# Altium project Drawdio.PrjPcb
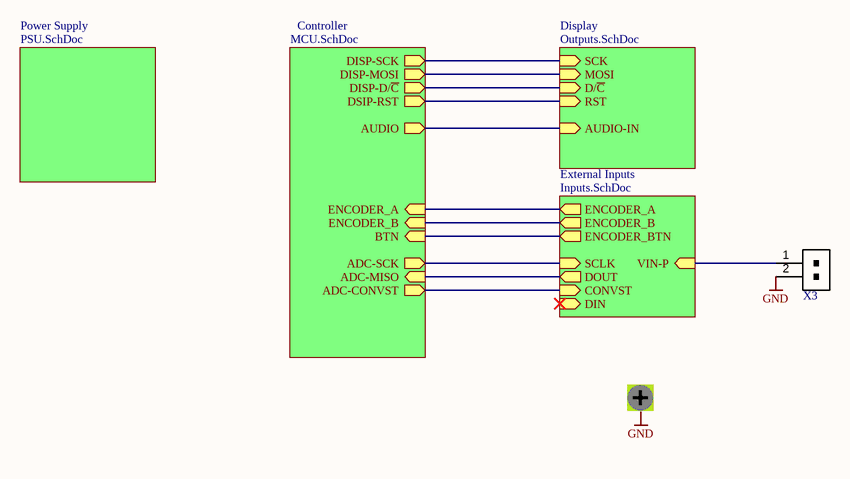
[diagram p0: Drawdio.SchDoc]
DrawingScale: 1:1; ProjAuthor: Szabó Péter; ProjName: Drawdio; ProjRev: Rev.1.0.
5 sheets, 116 parts. Net scope: hierarchical (ports join the sheet entries above them; power ports are global).
Board file: Drawdio.PcbDoc
Sheets:
  Drawdio.SchDoc
    Controller = MCU.SchDoc
    Power Supply = PSU.SchDoc
    External Inputs = Inputs.SchDoc
    Display = Outputs.SchDoc

## Sheet Drawdio.SchDoc: Drawdio w/ OLED dispaly
size 297 x 209 mm; DrawnBy: Szabó Péter; DocumentNumber: SP-0331; Revision: Rev.1.0.; SheetNumber: 1; SheetTotal: 5; Project: Drawdio; Scale: 1:1

### Parts
MH1  MECH - M2 screw  [MECH-M2 - no screw]  (value not drawn)
X3  CONN - 2P -THT-JST 2.00mm  [CONN-2P-THT-RIGHT-JST 2.00mm]  (value not drawn)

### Sub-sheets
Controller = MCU.SchDoc: BTN (in), ENCODER_B (in), ENCODER_A (in), DISP-MOSI (out), DISP-SCK (out), DSIP-RST (out), DISP-D/~{C} (out), ADC-CONVST (out), ADC-SCK (out), ADC-MISO (in), AUDIO (out)
Display = Outputs.SchDoc: MOSI (in), RST (in), SCK (in), D/~{C} (in), AUDIO-IN (in)
External Inputs = Inputs.SchDoc: ENCODER_A (out), ENCODER_B (out), ENCODER_BTN (out), DIN (in), SCLK (in), DOUT (out), CONVST (in), VIN-P (in)
Power Supply = PSU.SchDoc: no entries

### Nets
GND: MH1.MH(Con) X3.2
ADC-CONVST: sheet Controller/ADC-CONVST, sheet External Inputs/CONVST
ADC-MISO: sheet Controller/ADC-MISO, sheet External Inputs/DOUT
ADC-SCK: sheet Controller/ADC-SCK, sheet External Inputs/SCLK
BTN: sheet Controller/BTN, sheet External Inputs/ENCODER_BTN
DAC-OUT: sheet Controller/AUDIO, sheet Display/AUDIO-IN
DISP-D/~{C}: sheet Controller/DISP-D/~{C}, sheet Display/D/~{C}
DSIP-RST: sheet Controller/DSIP-RST, sheet Display/RST
ENC_A: sheet Controller/ENCODER_A, sheet External Inputs/ENCODER_A
ENC_B: sheet Controller/ENCODER_B, sheet External Inputs/ENCODER_B
SPI-MOSI: sheet Controller/DISP-MOSI, sheet Display/MOSI
SPI-SCK: sheet Controller/DISP-SCK, sheet Display/SCK
NetR29_3: X3.1 ; sheet External Inputs/VIN-P

### Notes on the sheet
- PROJECT NAME
- DATE
- TITLE
- TIME
- VERSION CONTROL
- N/A
- SIZE
- SCALE:
- A4
- FILE NAME
- DWG NO.
- SHEET
- REV
- OF
- DRAWN BY:

### Library data of the parts
MH1 = MECH - M2 screw: M3 hole with screw; Distributor: *; Order number: *
X3 = CONN - 2P -THT-JST 2.00mm: 1x2 pin THT connector; Order number: 100.385.23; 100.341.10; Distributor: Hestore

## Sheet MCU.SchDoc: Drawdio MCU
size 297 x 209 mm; DrawnBy: Szabó Péter; DocumentNumber: SP-0332; Revision: Rev.1.0.; SheetNumber: 2; SheetTotal: 5; Project: Drawdio; Scale: 1:1
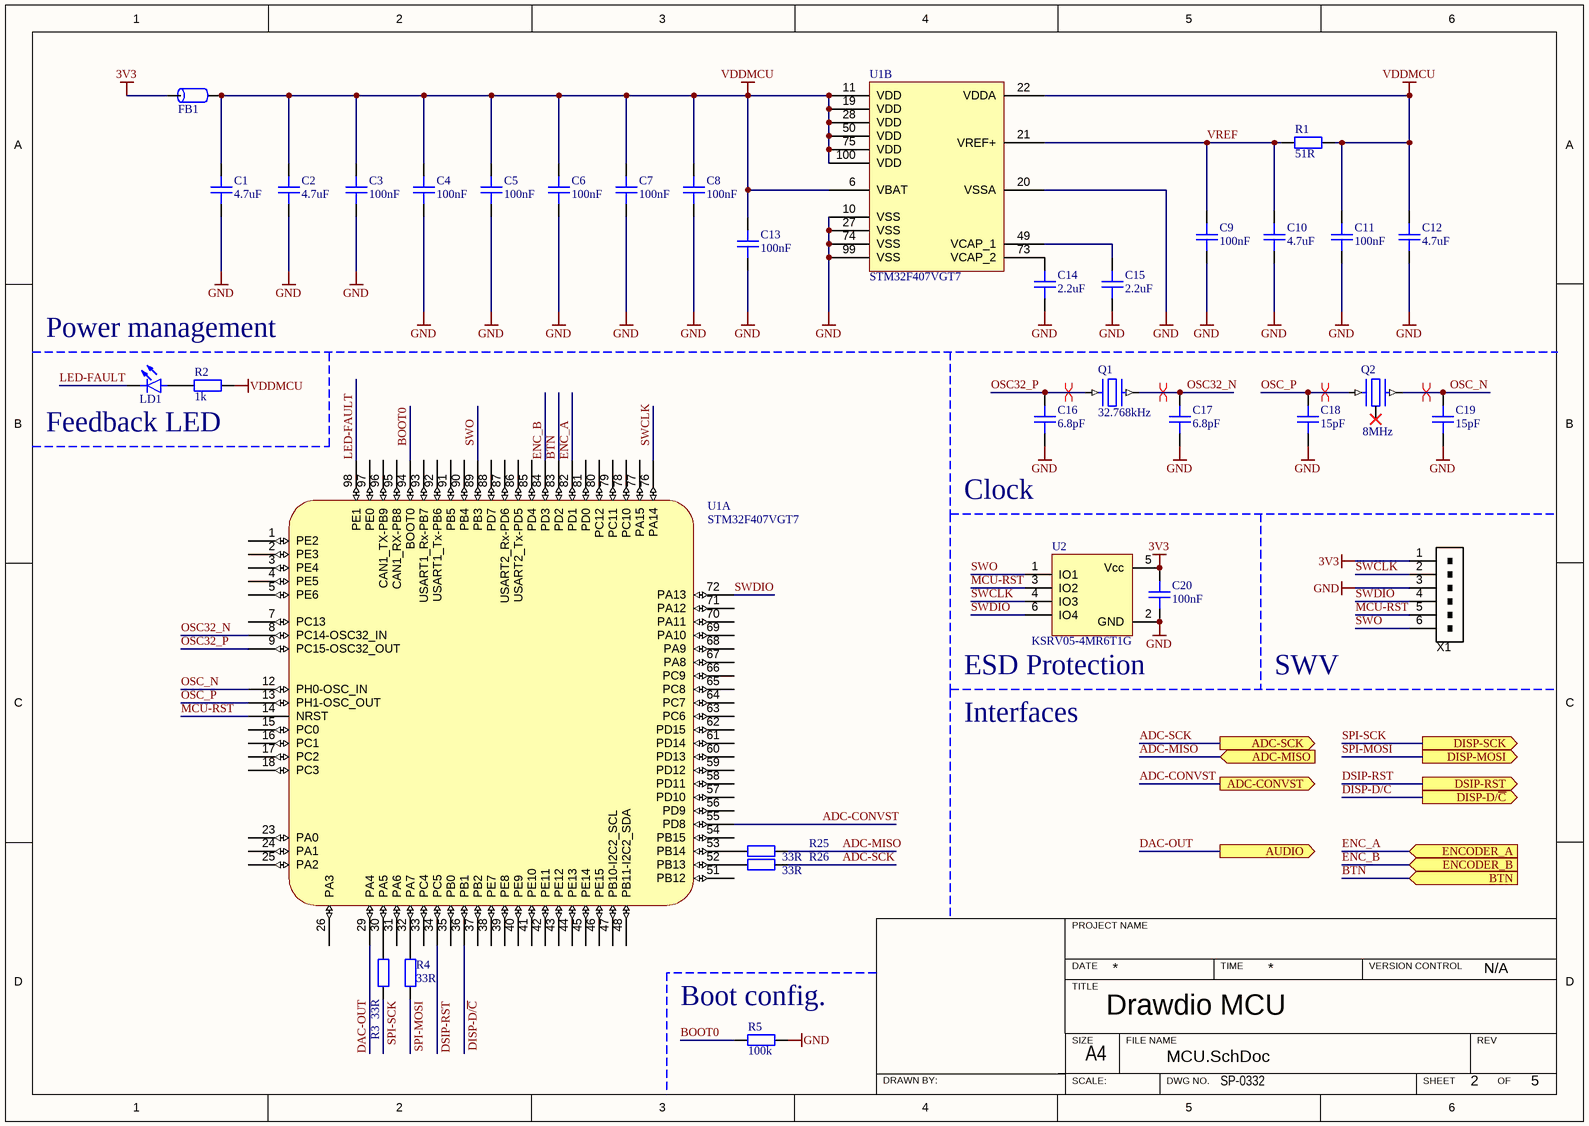
[diagram p1: MCU.SchDoc]

### Parts
C1  4.7uF  [CAP-0805]
C2  4.7uF  [CAP-0805]
C3  100nF  [CAP-0603]
C4  100nF  [CAP-0603]
C5  100nF  [CAP-0603]
C6  100nF  [CAP-0603]
C7  100nF  [CAP-0603]
C8  100nF  [CAP-0603]
C9  100nF  [CAP-0603]
C10  4.7uF  [CAP-0805]
C11  100nF  [CAP-0603]
C12  4.7uF  [CAP-0805]
C13  100nF  [CAP-0603]
C14  2.2uF  [CAP-0805]
C15  2.2uF  [CAP-0805]
C16  6.8pF  [CAP-0603]
C17  6.8pF  [CAP-0603]
C18  15pF  [CAP-0603]
C19  15pF  [CAP-0603]
C20  100nF  [CAP-0603]
FB1  FB - 0603  [FB-0603]  (value not drawn)
LD1  LED - 0603  [LED-0603]  (value not drawn)
Q1  32.768kHz  [OSC-3.2x1.5]
Q2  8MHz  [OSC-3.2x2.5]
R1  51R  [RES-0603]
R2  1k  [RES-0603]
R3  33R  [RES-0603]
R4  33R  [RES-0603]
R5  100k  [RES-0603]
R25  33R  [RES-0603]
R26  33R  [RES-0603]
U1  STM32F407VGT7  [IC-TQFP-100]  (parts A,B of 2)
U2  KSRV05-4MR6T1G  [T-SOT-23-6]
X1  CONN - SWV  [CONN-SWV-THT FEMALE]  (value not drawn)

### Ports
ADC-CONVST (out), ADC-MISO (in), ADC-SCK (out), AUDIO (out), BTN (in), DISP-D/~{C} (out), DISP-MOSI (out), DISP-SCK (out), DSIP-RST (out), ENCODER_A (in), ENCODER_B (in)

### Nets
3V3: C20.2 FB1.1 U2.5(Vcc) X1.1
GND: C1.1 C2.1 C3.1 C4.1 C5.1 C6.1 C7.1 C8.1 C9.1 C10.1 C11.1 C12.1 C13.1 C14.1 C15.1 C16.1 C17.1 C18.1 C19.1 C20.1 R5.2 U1.10(VSS) U1.20(VSSA) U1.27(VSS) U1.74(VSS) U1.99(VSS) U2.2(GND) X1.3
VDDMCU: C1.2 C2.2 C3.2 C4.2 C5.2 C6.2 C7.2 C8.2 C11.2 C12.2 C13.2 FB1.2 R1.2 R2.1 U1.6(VBAT) U1.11(VDD) U1.19(VDD) U1.22(VDDA) U1.28(VDD) U1.50(VDD) U1.75(VDD) U1.100(VDD)
ADC-CONVST: U1.55(PD8) ; port ADC-CONVST
ADC-MISO: R25.2 ; port ADC-MISO
ADC-SCK: R26.2 ; port ADC-SCK
BOOT0: R5.1 U1.94(BOOT0)
BTN: U1.83(PD2) ; port BTN
DAC-OUT: U1.29(PA4) ; port AUDIO
DISP-D/~{C}: U1.36(PB1) ; port DISP-D/~{C}
DSIP-RST: U1.34(PC5) ; port DSIP-RST
ENC_A: U1.82(PD1) ; port ENCODER_A
ENC_B: U1.84(PD3) ; port ENCODER_B
LED-FAULT: LD1.2(K) U1.98(PE1)
MCU-RST: U1.14(NRST) U2.3(IO2) X1.5
OSC32_N: C17.2 Q1.4 U1.8(PC14-OSC32_IN)
OSC32_P: C16.2 Q1.1 U1.9(PC15-OSC32_OUT)
OSC_N: C19.2 Q2.2 U1.12(PH0-OSC_IN)
OSC_P: C18.2 Q2.1 U1.13(PH1-OSC_OUT)
SPI-MOSI: R4.2 ; port DISP-MOSI
SPI-SCK: R3.2 ; port DISP-SCK
SWCLK: U1.76(PA14) U2.4(IO3) X1.2
SWDIO: U1.72(PA13) U2.6(IO4) X1.4
SWO: U1.89(PB3) U2.1(IO1) X1.6
VREF: C9.2 C10.2 R1.1 U1.21(VREF+)
NetC14_2: C14.2 U1.73(VCAP_2)
NetC15_2: C15.2 U1.49(VCAP_1)
NetLD1_1: LD1.1(A) R2.2
NetR3_1: R3.1 U1.30(PA5)
NetR4_1: R4.1 U1.32(PA7)
NetR25_1: R25.1 U1.53(PB14)
NetR26_1: R26.1 U1.52(PB13)

Not connected (* = marked no-connect by the designer): Q2 3*; U1 1(PE2) 2(PE3) 3(PE4) 4(PE5) 5(PE6) 7(PC13) 15(PC0) 16(PC1) 17(PC2) 18(PC3) 23(PA0) 24(PA1) 25(PA2) 26(PA3) 31(PA6) 33(PC4) 35(PB0) 37(PB2) 38(PE7) 39(PE8) 40(PE9) 41(PE10) 42(PE11) 43(PE12) 44(PE13) 45(PE14) 46(PE15) 47(PB10-I2C2_SCL) 48(PB11-I2C2_SDA) 51(PB12) 54(PB15) 56(PD9) 57(PD10) 58(PD11) 59(PD12) 60(PD13) 61(PD14) 62(PD15) 63(PC6) 64(PC7) 65(PC8) 66(PC9) 67(PA8) 68(PA9) 69(PA10) 70(PA11) 71(PA12) 77(PA15) 78(PC10) 79(PC11) 80(PC12) 81(PD0) 85(PD4) 86(USART2_Tx-PD5) 87(USART2_Rx-PD6) 88(PD7) 90(PB4) 91(PB5) 92(USART1_Tx-PB6) 93(USART1_Rx-PB7) 95(CAN1_RX-PB8) 96(CAN1_TX-PB9) 97(PE0)

### Layout directives
differential pair: OSC32_N, OSC32_P, OSC_N, OSC_P

### Notes on the sheet
- Power management
- Feedback LED
- Clock
- ESD Protection
- Interfaces
- SWV
- (near R5) Boot config.
- PROJECT NAME
- DATE
- TITLE
- TIME
- VERSION CONTROL
- N/A
- SIZE
- SCALE:
- A4
- FILE NAME
- DWG NO.
- SHEET
- REV
- OF
- DRAWN BY:

### Library data of the parts
C1 C2 C10 C12 C14 C15 = CAP - 0805: Capacitor Non-Polar; Distributor: *; Order number: *
  C1 C2 C10 C12: Value: 4.7uF
  C14 C15: Value: 2.2uF
C3-C9 C11 C13 C16-C20 = CAP - 0603: Capacitor Non-Polar; Distributor: *; Order number: *
  C3-C9 C11 C13 C20: Value: 100nF
  C16 C17: Value: 6.8pF
  C18 C19: Value: 15pF
FB1 = FB - 0603: Ferrit bead 0603
LD1 = LED - 0603: Single color LED; Distributor: *; Order number: *
Q1 = OSC - RTC: 32.768kHz quartz; Order number: 40-02-49; Distributor: Lomex
Q2 = OSC - MHZ SMD: 8MHz quartz; Value: 8MHz; Distributor: *; Order number: *
R1-R5 R25 R26 = RES - 0603: Resistor; Distributor: *; Order number: *
  R1: Value: 51R
  R2: Value: 1k
  R3 R4 R25 R26: Value: 33R
  R5: Value: 100k
U1 = IC - STM32F407VGxx: High-performance and DSP with FPU, ARM Cortex-M4 MCU with 1 Mbyte Flash, 168 MHz CPU, Art Accelerator, Ethernet; Order number: 2064368; Distributor: Farnell; Supplier 1: Farnell; Supplier Part Number 1: 2333298
U2 = D - KSRV05: ESD supressor, max. 28V, 150W; Order number: 100.459.44; Distributor: Hestore
X1 = CONN - SWV: SWD view and program connector; Distributor: *; Order number: *

## Sheet PSU.SchDoc: Power Supply
size 297 x 209 mm; DrawnBy: Szabó Péter; DocumentNumber: SP-0333; Revision: Rev.1.0.; SheetNumber: 3; SheetTotal: 5; Project: Drawdio; Scale: 1:1
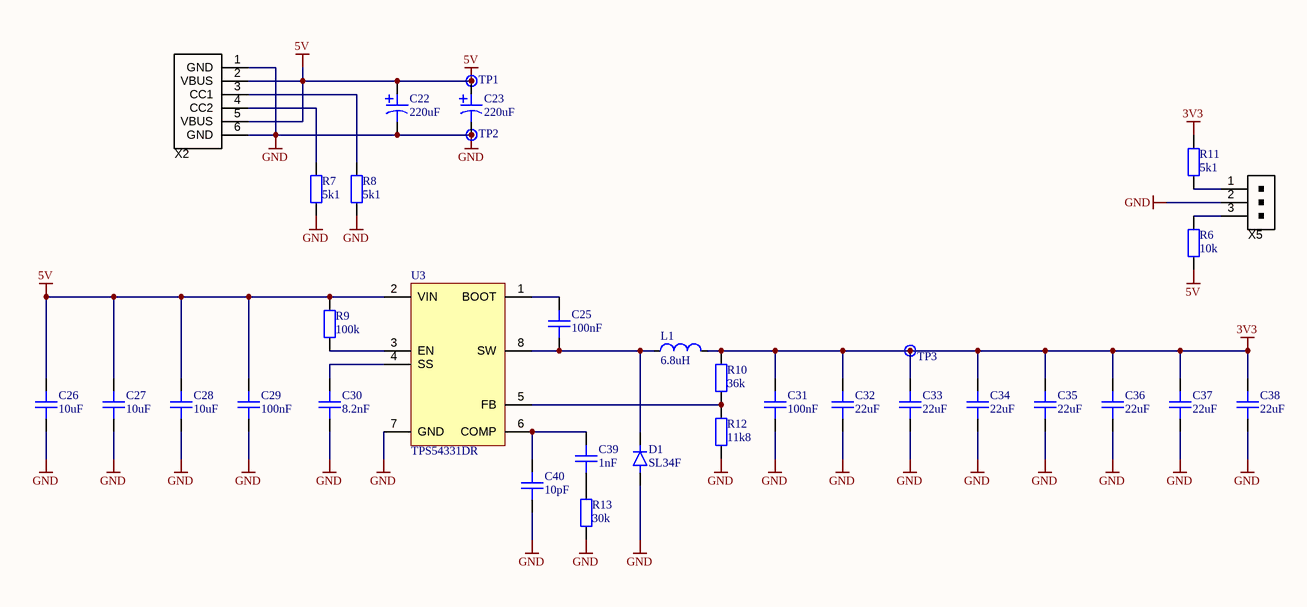
[diagram p2: PSU.SchDoc]

### Parts
C22  220uF  [CAP-TANT-D]
C23  220uF  [CAP-TANT-D]
C25  100nF  [CAP-0603]
C26  10uF  [CAP-0805]
C27  10uF  [CAP-0805]
C28  10uF  [CAP-0805]
C29  100nF  [CAP-0805]
C30  8.2nF  [CAP-0603]
C31  100nF  [CAP-0805]
C32  22uF  [CAP-0805]
C33  22uF  [CAP-0805]
C34  22uF  [CAP-0805]
C35  22uF  [CAP-0805]
C36  22uF  [CAP-0805]
C37  22uF  [CAP-0805]
C38  22uF  [CAP-0805]
C39  1nF  [CAP-0603]
C40  10pF  [CAP-0603]
D1  SL34F  [D-SMAF]
L1  6.8uH  [IND-SMD-6.5x6.5mm]
R6  10k  [RES-0603]
R7  5k1  [RES-0603]
R8  5k1  [RES-0603]
R9  100k  [RES-0603]
R10  36k  [RES-0603]
R11  5k1  [RES-0603]
R12  11k8  [RES-0603]
R13  30k  [RES-0603]
TP1  MISC - Testpoint SMT  [MISC-TESTPOINT-SMT]  (value not drawn)  (no BOM)
TP2  MISC - Testpoint SMT  [MISC-TESTPOINT-SMT]  (value not drawn)  (no BOM)
TP3  MISC - Testpoint SMT  [MISC-TESTPOINT-SMT]  (value not drawn)  (no BOM)
U3  TPS54331DR  [IC-SOIC-8]
X2  CONN - USB-C  [CONN-USB-C]  (value not drawn)
X5  CONN - 3P - THT-JST 1.5mm  [CONN-3P-THT-JST 1.5mm]  (value not drawn)

### Nets
3V3: C31.2 C32.2 C33.2 C34.2 C35.2 C36.2 C37.2 C38.2 L1.2 R10.2 R11.2 TP3.1
5V: C22.2 C23.2 C26.2 C27.2 C28.2 C29.2 R6.2 R9.1 TP1.1 U3.2(VIN) X2.2(VBUS) X2.5(VBUS)
GND: C22.1 C23.1 C26.1 C27.1 C28.1 C29.1 C30.1 C31.1 C32.1 C33.1 C34.1 C35.1 C36.1 C37.1 C38.1 C40.1 D1.1 R7.1 R8.1 R12.1 R13.1 TP2.1 U3.7(GND) X2.1(GND) X2.6(GND) X5.2
NetC25_1: C25.1 D1.2 L1.1 U3.8(SW)
NetC25_2: C25.2 U3.1(BOOT)
NetC30_2: C30.2 U3.4(SS)
NetC39_1: C39.1 R13.2
NetC39_2: C39.2 C40.2 U3.6(COMP)
NetR6_1: R6.1 X5.3
NetR7_2: R7.2 X2.4(CC2)
NetR8_2: R8.2 X2.3(CC1)
NetR9_2: R9.2 U3.3(EN)
NetR10_1: R10.1 R12.2 U3.5(FB)
NetR11_1: R11.1 X5.1

### Notes on the sheet
- PROJECT NAME
- DATE
- TITLE
- TIME
- VERSION CONTROL
- N/A
- SIZE
- SCALE:
- A4
- FILE NAME
- DWG NO.
- SHEET
- REV
- OF
- DRAWN BY:

### Library data of the parts
C22 C23 = CAP - TANT - D: Capacitor Polar; Distributor: Lomex; Order number: 92-01-29; Value: 220uF
C25 C30 C39 C40 = CAP - 0603: Capacitor Non-Polar; Distributor: *; Order number: *
  C25: Value: 100nF
  C30: Value: 8.2nF
  C39: Value: 1nF
  C40: Value: 10pF
C26-C29 C31-C38 = CAP - 0805: Capacitor Non-Polar; Distributor: *; Order number: *
  C26-C28: Value: 10uF
  C29 C31: Value: 100nF
  C32-C38: Value: 22uF
D1 = D - SL34F: 3A 600V DO-214AB RECT.SUP.FAST trr<35ns ES3J; PartNumber: SL34F; Distributor: Lomex; Order number: 83-07-60
L1 = IND - SMD: 12.7x12.7mm choke inductor; Order number: 100.434.72; 93-03-26; Value: 6.8uH; Distributor: Hestore; Lomex
R6-R13 = RES - 0603: Resistor; Distributor: *; Order number: *
  R6: Value: 10k
  R7 R8 R11: Value: 5k1
  R9: Value: 100k
  R10: Value: 36k
  R12: Value: 11k8
  R13: Value: 30k
TP1-TP3 = MISC - Testpoint SMT: SMT testpoint
U3 = IC - TPS54331: 3-A, 28-V Input, Step Down DC-DC Converter With Eco-mode; Order number: 100.408.80; Distributor: Hestore; Supplier 1: Mouser; Supplier Part Number 1: 595-TPS54331DR
X2 = CONN - USB-C: USB-C connector, power supply only; Order number: 100.469.71; ComponentLink1Description: DataSheet; Distributor: Hestore
X5 = CONN - 3P - THT-JST 1.5mm: 1x3 pin header; Distributor: *; Order number: *

## Sheet Inputs.SchDoc: External Inputs
size 297 x 209 mm; DrawnBy: Szabó Péter; DocumentNumber: SP-0334; Revision: Rev.1.0.; SheetNumber: 4; SheetTotal: 5; Project: Drawdio; Scale: 1:1
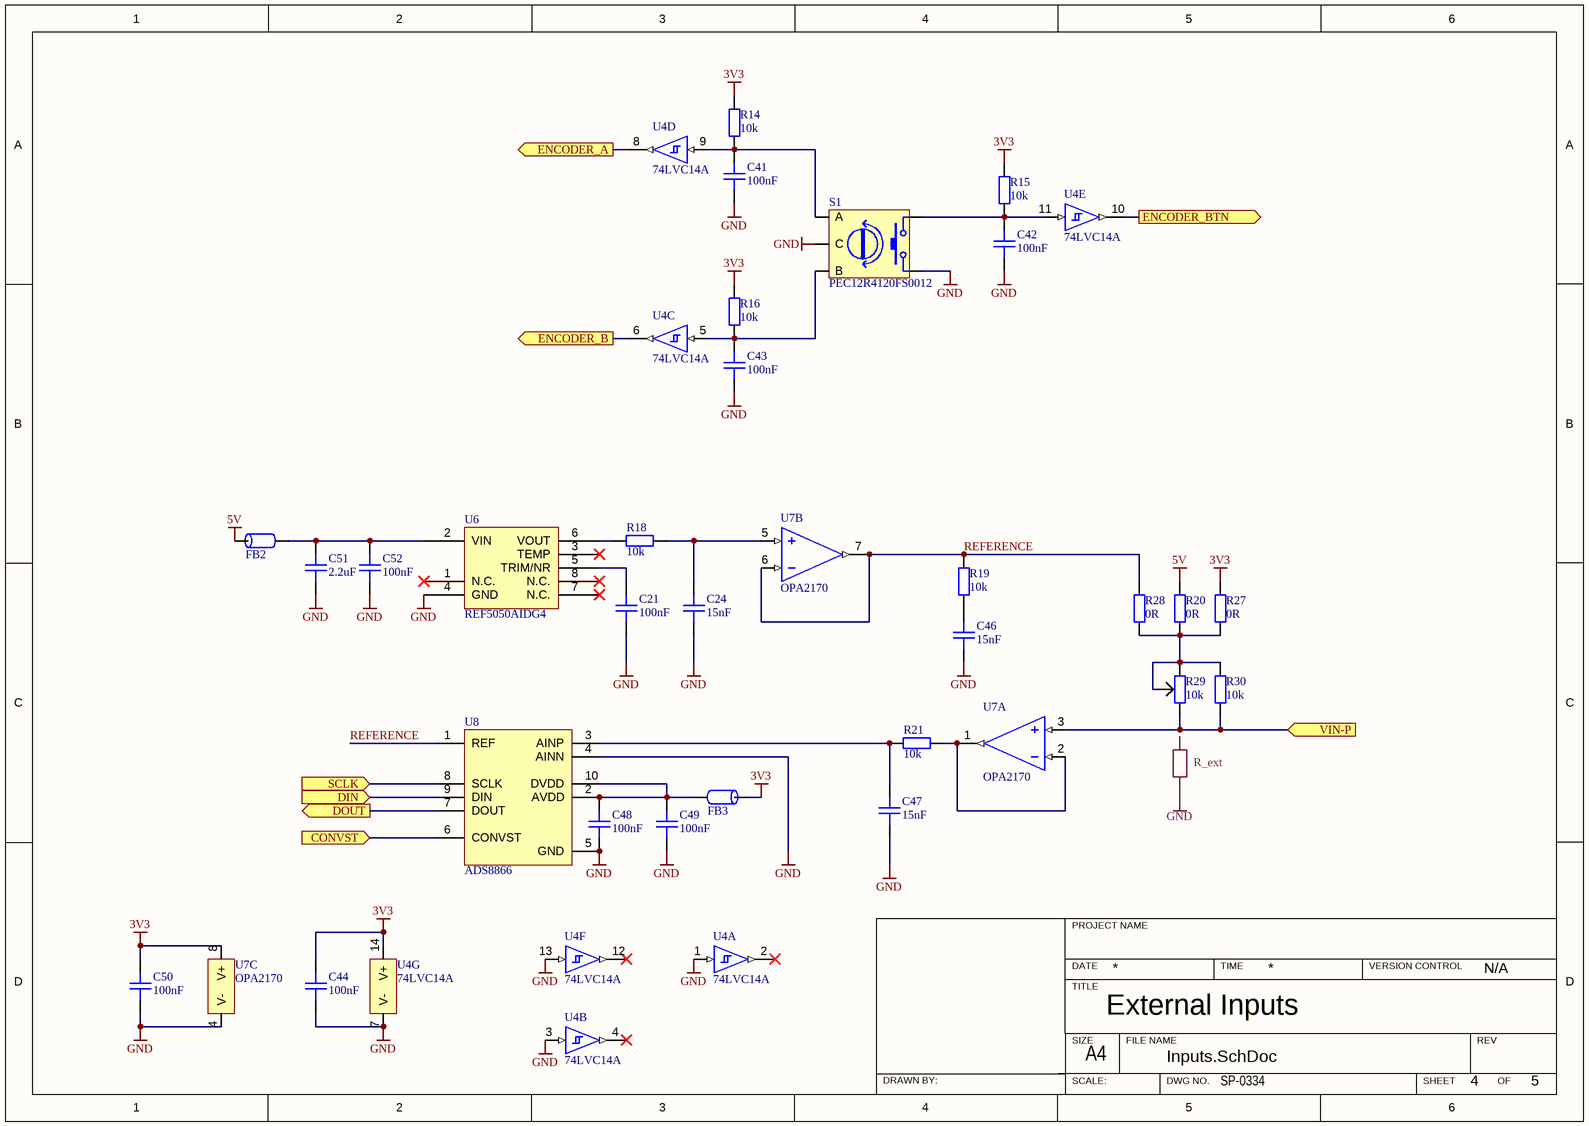
[diagram p3: Inputs.SchDoc]

### Parts
C21  100nF  [CAP-0603]
C24  15nF  [CAP-0603]
C41  100nF  [CAP-0603]
C42  100nF  [CAP-0603]
C43  100nF  [CAP-0603]
C44  100nF  [CAP-0603]
C46  15nF  [CAP-0603]
C47  15nF  [CAP-0603]
C48  100nF  [CAP-0603]
C49  100nF  [CAP-0603]
C50  100nF  [CAP-0603]
C51  2.2uF  [CAP-0805]
C52  100nF  [CAP-0603]
FB2  FB - 0603  [FB-0603]  (value not drawn)
FB3  FB - 0603  [FB-0603]  (value not drawn)
R14  10k  [RES-0603]
R15  10k  [RES-0603]
R16  10k  [RES-0603]
R18  10k  [RES-0603]
R19  10k  [RES-0603]
R20  0R  [RES-0603]
R21  10k  [RES-0603]
R27  0R  [RES-0603]
R28  0R  [RES-0603]
R29  10k  [RES-TRIM-SMD]
R30  10k  [RES-0603]
S1  PEC12R4120FS0012  [BTN-ENCODER-12pos]
U4  74LVC14A  [IC-SOIC-14]  (parts A,B,C,D,E,F,G of 7)
U6  REF5050AIDG4  [IC-SOIC-8]
U7  OPA2170  [IC-SOIC-8]  (parts A,B,C of 3)
U8  ADS8866  [IC-VSSOP-10]

### Ports
CONVST (in), DIN (in), DOUT (out), ENCODER_A (out), ENCODER_B (out), ENCODER_BTN (out), SCLK (in), VIN-P (in)

### Nets
3V3: C44.2 C50.2 FB3.1 R14.1 R15.1 R16.1 R27.2 U4.14(V+) U7.8(V+)
5V: FB2.1 R20.2
GND: C21.1 C24.1 C41.1 C42.1 C43.1 C44.1 C46.1 C47.1 C48.1 C49.1 C50.1 C51.1 C52.1 S1.2(C) S1.5 U4.1(A) U4.3(A) U4.7(V-) U4.13(A) U6.4(GND) U7.4(V-) U8.4(AINN) U8.5(GND)
ADC-CONVST: U8.6(CONVST) ; port CONVST
ADC-MISO: U8.7(DOUT) ; port DOUT
ADC-SCK: U8.8(SCLK) ; port SCLK
BTN: U4.10(Y) ; port ENCODER_BTN
ENC_A: U4.8(Y) ; port ENCODER_A
ENC_B: U4.6(Y) ; port ENCODER_B
REFERENCE: R19.2 R28.2 U7.6(IN-) U7.7(OUT) U8.1(REF)
NetC21_2: C21.2 U6.5(TRIM/NR)
NetC24_2: C24.2 R18.2 U7.5(IN+)
NetC41_2: C41.2 R14.2 S1.1(A) U4.9(A)
NetC42_2: C42.2 R15.2 S1.4 U4.11(A)
NetC43_2: C43.2 R16.2 S1.3(B) U4.5(A)
NetC46_2: C46.2 R19.1
NetC47_2: C47.2 R21.1 U8.3(AINP)
NetC48_2: C48.2 C49.2 FB3.2 U8.2(AVDD) U8.10(DVDD)
NetC51_2: C51.2 C52.2 FB2.2 U6.2(VIN)
NetR18_1: R18.1 U6.6(VOUT)
NetR20_1: R20.1 R27.1 R28.1 R29.1 R29.2 R30.2
NetR21_2: R21.2 U7.1(OUT) U7.2(IN-)
NetR29_3: R29.3 R30.1 U7.3(IN+) ; port VIN-P
NetU8_9: U8.9(DIN) ; port DIN

Not connected (* = marked no-connect by the designer): U4 2(Y)* 4(Y)* 12(Y)*; U6 1(N.C.)* 3(TEMP)* 7(N.C.)* 8(N.C.)*

### Notes on the sheet
- R_ext
- GND
- PROJECT NAME
- DATE
- TITLE
- TIME
- VERSION CONTROL
- N/A
- SIZE
- SCALE:
- A4
- FILE NAME
- DWG NO.
- SHEET
- REV
- OF
- DRAWN BY:

### Library data of the parts
C21 C24 C41-C44 C46-C50 C52 = CAP - 0603: Capacitor Non-Polar
  C21 C41-C44 C48-C50 C52: Value: 100nF; Distributor: *; Order number: *
  C24 C46: Value: 15nF; Distributor: *; Order number: *
  C47: Value: 15nF; Distributor: Lomex; Order number: 82-15-10
C51 = CAP - 0805: Capacitor Non-Polar; Value: 2.2uF; Distributor: *; Order number: *
FB2 FB3 = FB - 0603: Ferrit bead 0603; Distributor: Lomex; Order Number: *
R14-R16 R18-R21 R27 R28 R30 = RES - 0603: Resistor
  R14-R16 R18 R19: Value: 10k; Distributor: *; Order number: *
  R20 R27 R28: Value: 0R; Distributor: Lomex; Order number: 80-11-68
  R21 R30: Value: 10k; Distributor: Lomex; Order number: 80-11-68
R29 = RES - POT - TRIM - SMD: Trim Potentiometer; Order number: 4014863; Distributor: Farnell; Value: 10k; Supplier 1: RSComponents; Supplier Part Number 1: 6696691P
S1 = BTN - Encoder 12pos: Encoder with Push Button; Order number: 100.387.49; ComponentLink1Description: DataSheet; Distributor: Hestore
U4 = IC - 74LVC14: 6xINVERTING GATE SCHMITT-TRIGGER SO-14; ComponentLink1Description: DataSheet; Distributor: Lomex; Order number: 87-04-56; Value: 74LVC14A
U6 = IC - REF5050: Enhanced Product Low-Noise, Very Low Drift, Precision Voltage Reference, 5V; Order number: 100.386.03; Distributor: Hestore; Supplier 1: Mouser; Supplier Part Number 1: 595-REF5050AIDG4
U7 = IC - OPA2170: Low-Power, Dual-Operational Amplifiers; ComponentLink1Description: DataSheet; ComponentLink1URL: https://www.ti.com/lit/ds/symlink/opa2170.pdf?ts=1699036711414; Distributor: N/A; Order number: N/A; Value: OPA2170
U8 = IC - ADS8866: ADC; Order number: 595-ADS8866IDGS; Distributor: Mouser; Supplier 1: Mouser; Supplier Part Number 1: 595-ADS8866IDGSR

## Sheet Outputs.SchDoc: Outputs
size 297 x 209 mm; DrawnBy: Szabó Péter; DocumentNumber: SP-0335; Revision: Rev.1.0.; SheetNumber: 5; SheetTotal: 5; Project: Drawdio; Scale: 1:1
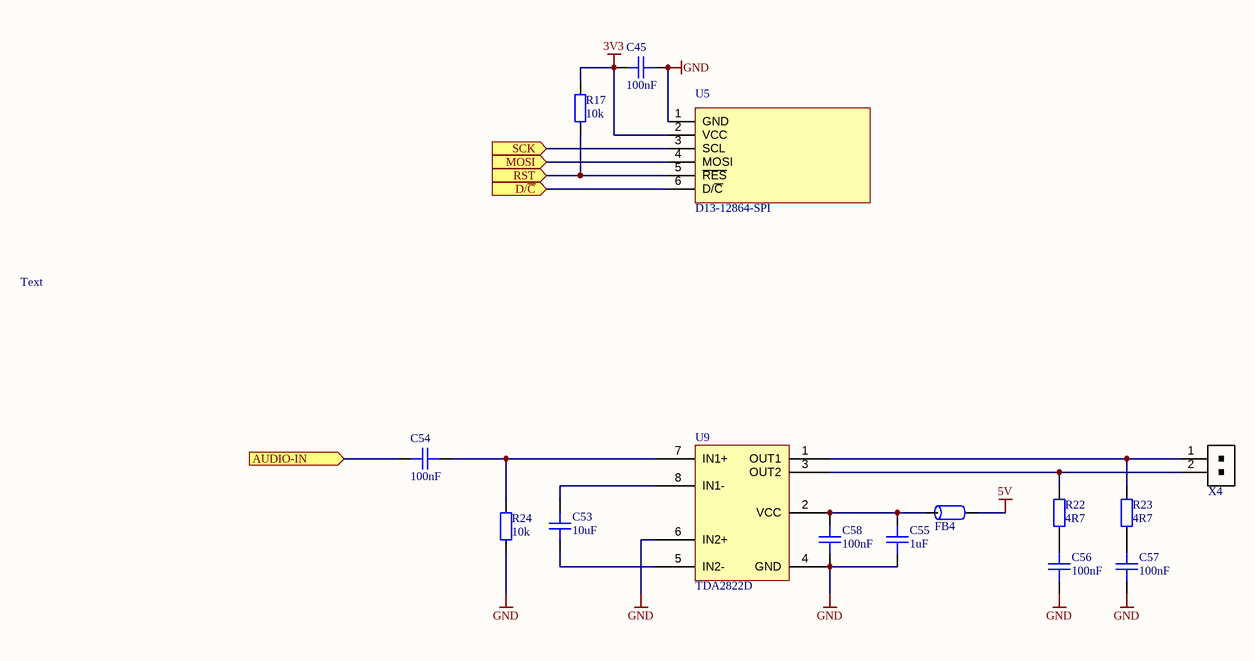
[diagram p4: Outputs.SchDoc]

### Parts
C45  100nF  [CAP-0603]
C53  10uF  [CAP-0805]
C54  100nF  [CAP-0603]
C55  1uF  [CAP-0805]
C56  100nF  [CAP-0603]
C57  100nF  [CAP-0603]
C58  100nF  [CAP-0603]
FB4  FB - 0603  [FB-0603]  (value not drawn)
R17  10k  [RES-0603]
R22  4R7  [RES-0603]
R23  4R7  [RES-0603]
R24  10k  [RES-0603]
U5  D13-12864-SPI  [MISC-OLED DISPLAY-128x64]
U9  TDA2822D  [IC-SOIC-8]
X4  CONN - 2P -THT-JST 2.00mm  [CONN-2P-THT-RIGHT-JST 2.00mm]  (value not drawn)

### Ports
AUDIO-IN (in), D/~{C} (in), MOSI (in), RST (in), SCK (in)

### Nets
3V3: C45.2 R17.2 U5.2(VCC)
5V: FB4.2
GND: C45.1 C55.1 C56.2 C57.2 C58.1 R24.1 U5.1(GND) U9.4(GND) U9.6(IN2+)
DAC-OUT: C54.1 ; port AUDIO-IN
DISP-D/~{C}: U5.6(D/~{C}) ; port D/~{C}
DSIP-RST: R17.1 U5.5(~{RES}) ; port RST
SPI-MOSI: U5.4(MOSI) ; port MOSI
SPI-SCK: U5.3(SCL) ; port SCK
NetC53_1: C53.1 U9.5(IN2-)
NetC53_2: C53.2 U9.8(IN1-)
NetC54_2: C54.2 R24.2 U9.7(IN1+)
NetC55_2: C55.2 C58.2 FB4.1 U9.2(VCC)
NetC56_1: C56.1 R22.1
NetC57_1: C57.1 R23.1
NetR22_2: R22.2 U9.3(OUT2) X4.2
NetR23_2: R23.2 U9.1(OUT1) X4.1

### Notes on the sheet
- Text
- PROJECT NAME
- DATE
- TITLE
- TIME
- VERSION CONTROL
- N/A
- SIZE
- SCALE:
- A4
- FILE NAME
- DWG NO.
- SHEET
- REV
- OF
- DRAWN BY:

### Library data of the parts
C45 C54 C56-C58 = CAP - 0603: Capacitor Non-Polar; Value: 100nF; Distributor: *; Order number: *
C53 C55 = CAP - 0805: Capacitor Non-Polar; Distributor: *; Order number: *
  C53: Value: 10uF
  C55: Value: 1uF
FB4 = FB - 0603: Ferrit bead 0603; Distributor: Lomex; Order Number: *
R17 R22-R24 = RES - 0603: Resistor; Distributor: *; Order number: *
  R17 R24: Value: 10k
  R22 R23: Value: 4R7
U5 = MISC - D13-12864-SPI: 1.3in 128x64 OLED, SPI interface, SH1106; Order number: 100.356.08; ComponentLink1Description: DataSheet; Distributor: Hestore
U9 = IC - TDA2822: DUAL LOW-VOLTAGE POWER AMPLIFIER, 1W, 4-32 Ohm; Order number: 100.463.57; Distributor: Hestore; Supplier 1: RS; Supplier Part Number 1: 426162P
X4 = CONN - 2P -THT-JST 2.00mm: as X3 on sheet Drawdio; Distributor: Hestore

## Nets that join several sheets
3V3: MCU (C20.2 FB1.1 U2.5 X1.1), PSU (12 pins), Inputs (9 pins), Outputs (C45.2 R17.2 U5.2)
5V: PSU (12 pins), Inputs (FB2.1 R20.2), Outputs (FB4.2)
GND: Drawdio (MH1.MH X3.2), MCU (28 pins), PSU (26 pins), Inputs (23 pins), Outputs (9 pins)
ADC-CONVST: MCU (U1.55), Inputs (U8.6)
ADC-MISO: MCU (R25.2), Inputs (U8.7)
ADC-SCK: MCU (R26.2), Inputs (U8.8)
BTN: MCU (U1.83), Inputs (U4.10)
DAC-OUT: MCU (U1.29), Outputs (C54.1)
DISP-D/~{C}: MCU (U1.36), Outputs (U5.6)
DSIP-RST: MCU (U1.34), Outputs (R17.1 U5.5)
ENC_A: MCU (U1.82), Inputs (U4.8)
ENC_B: MCU (U1.84), Inputs (U4.6)
NetR29_3: Drawdio (X3.1), Inputs (R29.3 R30.1 U7.3)
SPI-MOSI: MCU (R4.2), Outputs (U5.4)
SPI-SCK: MCU (R3.2), Outputs (U5.3)

## Assembly variants
Default: not fitted R27 R? R?; alternate parts C54 -> CAP - 0603